# EAGLE design Un_Arduino (EAGLE 6.5.0)
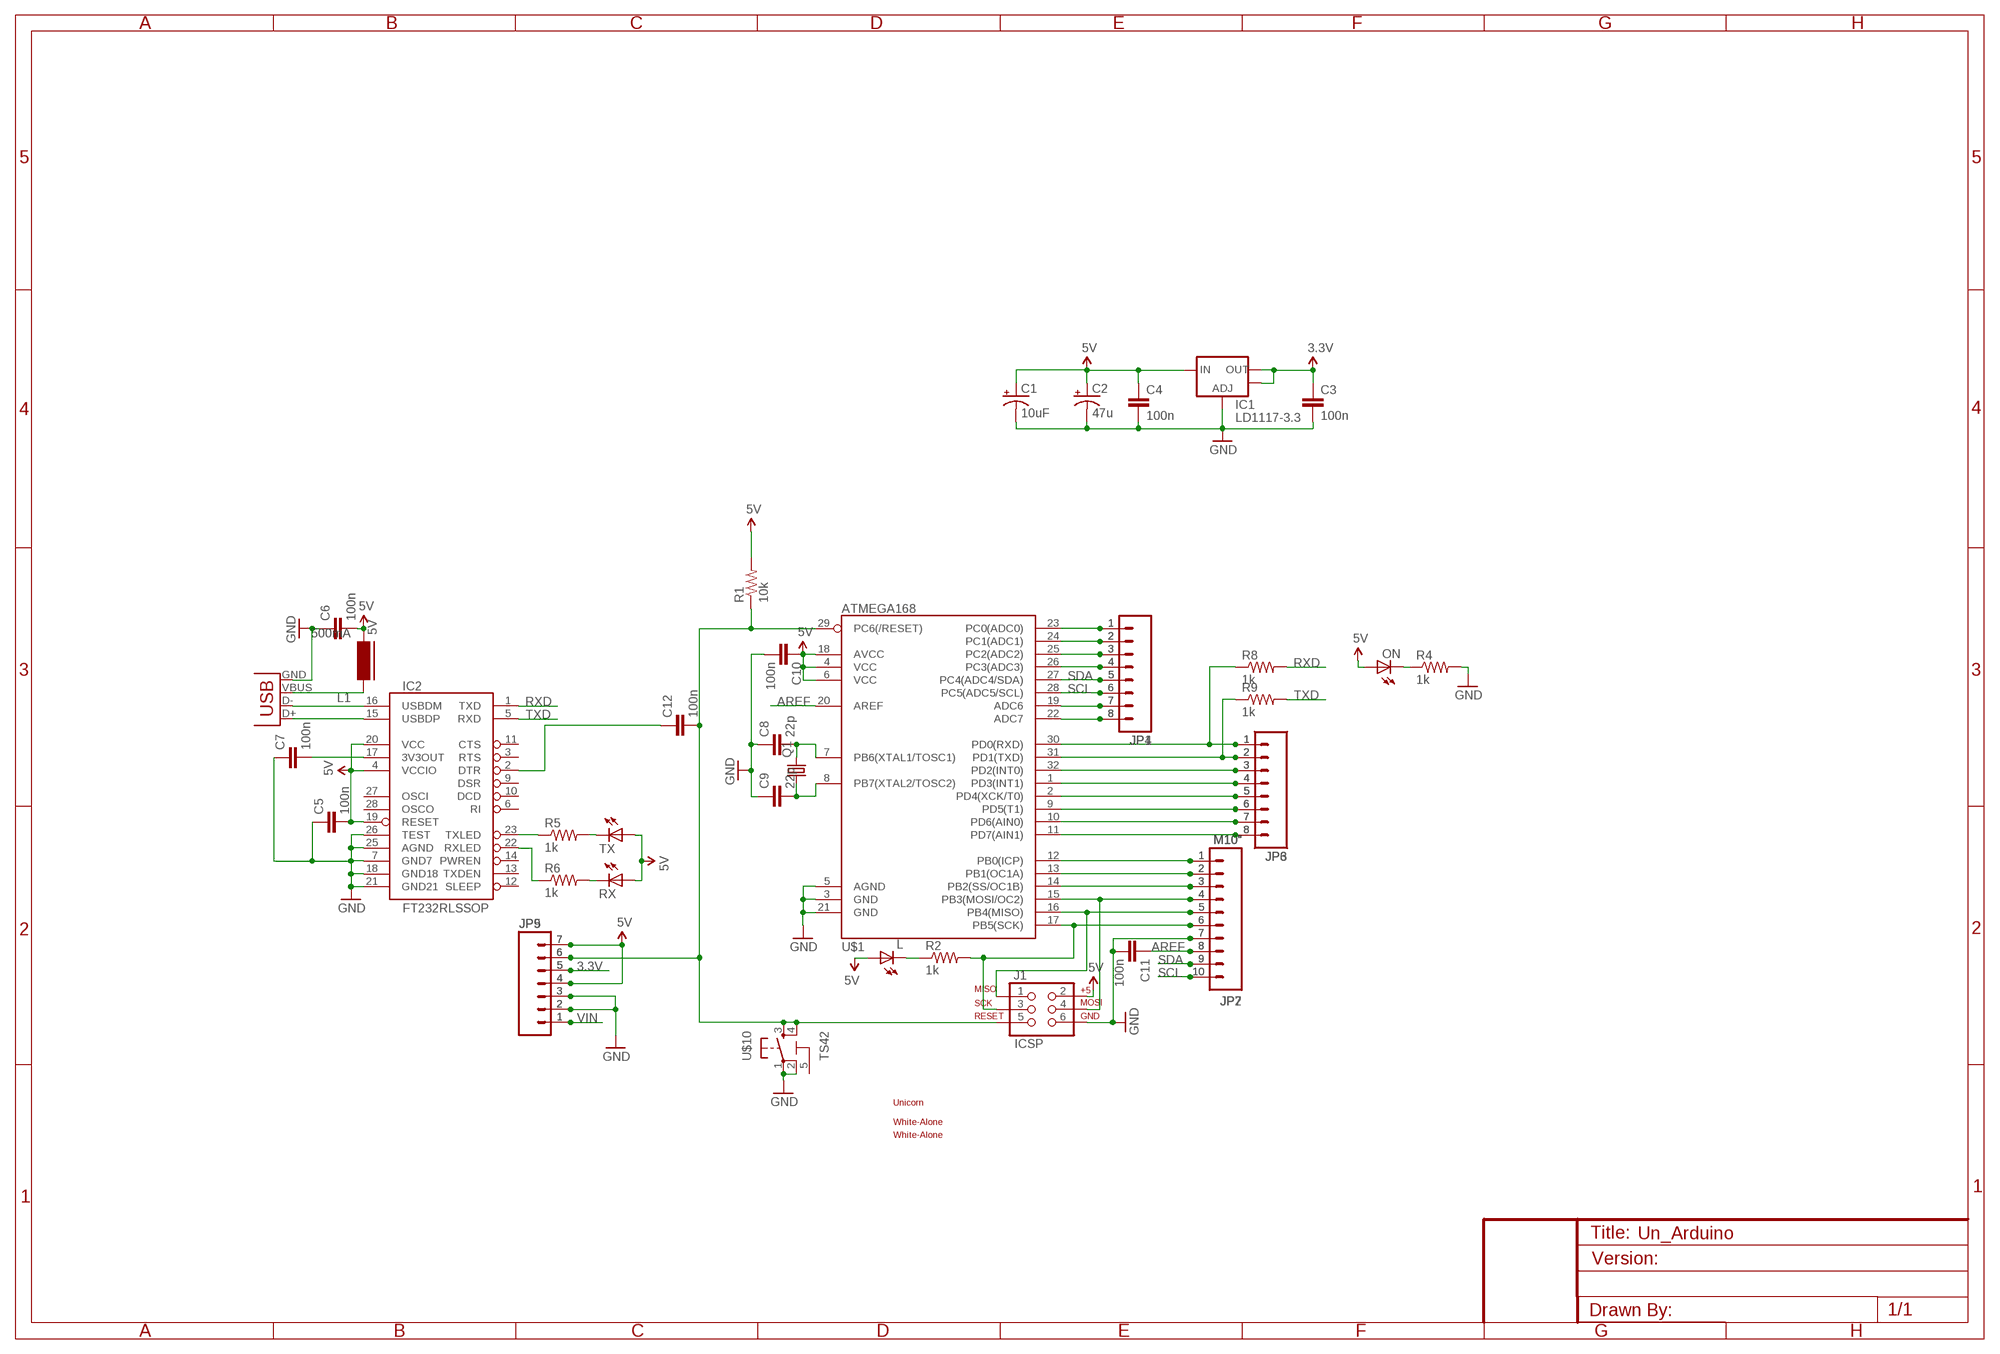
[diagram p0: schematic, sheet 1]

## Parts
C1  10uF  CAP_POL1206  [EIA3216]
C2  47u  CAP_POLD  [PANASONIC_D]
C3  100n  CAP0603-CAP  [0603-CAP]
C4  100n  CAP0603-CAP  [0603-CAP]
C5  100n  CAP0603-CAP  [0603-CAP]
C6  100n  CAP0603-CAP  [0603-CAP]
C7  100n  CAP0603-CAP  [0603-CAP]
C8  22p  CAP0603-CAP  [0603-CAP]
C9  22p  CAP0603-CAP  [0603-CAP]
C10  100n  CAP0603-CAP  [0603-CAP]
C11  100n  CAP0603-CAP  [0603-CAP]
C12  100n  CAP0603-CAP  [0603-CAP]
IC1  LD1117-3.3  V_REG_LM1117SOT223  [SOT223]
IC2  FT232RLSSOP  [SSOP28DB]
J1  ICSP  AVR_SPI_PRG_6PTH  [2X3]
JP1  M081X08  [1X08]
JP2  M10"  [1X10]
JP3  M08  [1X08]
JP4  M081X08  [1X08]
JP5  M07  [1X07]
JP6  M08  [1X08]
JP7  M10"  [1X10]
JP9  M07  [1X07]
L  LED0805  [LED-0805]
L1  500mA  FERRITE-0805  [FB805]
ON  LED0805  [LED-0805]
Q1  CRYSTALHC49US  [HC49US]
R1  10k  RESISTOR0603-RES  [0603-RES]
R2  1k  RESISTOR0603-RES  [0603-RES]
R4  1k  RESISTOR0603-RES  [0603-RES]
R5  1k  RESISTOR0603-RES  [0603-RES]
R6  1k  RESISTOR0603-RES  [0603-RES]
R8  1k  RESISTOR0603-RES  [0603-RES]
R9  1k  RESISTOR0603-RES  [0603-RES]
RX  LED0805  [LED-0805]
TX  LED0805  [LED-0805]
U$1  ATMEGA168  [TQFP32-08]
U$4  UNICORN  [UNICORN_1]
U$10  TS42  [TS42]
U$13  WHITE-ALONE_0  [WHITE-ALONE_0]
U$14  WHITE-ALONE_0  [WHITE-ALONE_0]
X1  USBSMD  [USB-MINIB]

## Nets
3.3V: C3.1 IC1.2(OUT) IC1.4(OUT) JP5.5 JP9.5
5V: C1.A(+) C2.+ C4.1 C5.2 C6.2 C10.1 IC1.3(IN) IC2.4(VCCIO) IC2.19(RESET) IC2.20(VCC) J1.2 JP5.4 JP5.7 JP9.4 JP9.7 L1.2 L.1(A) ON.1(A) R1.2 RX.1(A) TX.1(A) U$1.4(VCC) U$1.6(VCC) U$1.18(AVCC)
A0: JP1.1 JP4.1 U$1.23(PC0(ADC0))
AREF: C11.1 JP2.8 JP7.8 U$1.20(AREF)
GND: C1.C(-) C2.- C3.2 C4.2 C5.1 C6.1 C7.1 C8.1 C9.1 C10.2 C11.2 IC1.1(ADJ) IC2.7(GND7) IC2.18(GND18) IC2.21(GND21) IC2.25(AGND) IC2.26(TEST) J1.6 JP2.7 JP5.2 JP5.3 JP7.7 JP9.2 JP9.3 R4.2 U$1.3(GND) U$1.5(AGND) U$1.21(GND) U$10.1 U$10.2 X1.GND
IO0: JP3.1 JP6.1 R8.1 U$1.30(PD0(RXD))
N$1: C7.2 IC2.17(3V3OUT)
N$2: IC2.23(TXLED) R5.1
N$3: L1.1 X1.VBUS
N$4: R5.2 TX.2(C)
N$5: IC2.16(USBDM) X1.D-
N$6: IC2.15(USBDP) X1.D+
N$7: R6.2 RX.2(C)
N$8: ON.2(C) R4.1
N$9: L.2(C) R2.1
N$10: IC2.22(RXLED) R6.1
N$12: JP1.7 JP4.7 U$1.19(ADC6)
N$13: JP1.8 JP4.8 U$1.22(ADC7)
N$15: C12.1 IC2.2(DTR)
N$16: JP2.1 JP7.1 U$1.12(PB0(ICP))
N$17: JP2.2 JP7.2 U$1.13(PB1(OC1A))
N$18: JP2.3 JP7.3 U$1.14(PB2(SS/OC1B))
N$19: J1.4 JP2.4 JP7.4 U$1.15(PB3(MOSI/OC2))
N$20: J1.1 JP2.5 JP7.5 U$1.16(PB4(MISO))
N$23: JP3.2 JP6.2 R9.1 U$1.31(PD1(TXD))
N$24: JP3.3 JP6.3 U$1.32(PD2(INT0))
N$25: JP3.4 JP6.4 U$1.1(PD3(INT1))
N$26: JP3.5 JP6.5 U$1.2(PD4(XCK/T0))
N$27: JP3.6 JP6.6 U$1.9(PD5(T1))
N$28: JP3.7 JP6.7 U$1.10(PD6(AIN0))
N$29: JP3.8 JP6.8 U$1.11(PD7(AIN1))
N$31: JP1.2 JP4.2 U$1.24(PC1(ADC1))
N$32: JP1.3 JP4.3 U$1.25(PC2(ADC2))
N$33: JP1.4 JP4.4 U$1.26(PC3(ADC3))
N$38: C12.2 J1.5 JP5.6 JP9.6 R1.1 U$1.29(PC6(/RESET)) U$10.3 U$10.4
N$39: C8.2 Q1.2 U$1.7(PB6(XTAL1/TOSC1))
N$40: C9.2 Q1.1 U$1.8(PB7(XTAL2/TOSC2))
RXD: IC2.1(TXD) R8.2
SCK: J1.3 JP2.6 JP7.6 R2.2 U$1.17(PB5(SCK))
SCL: JP1.6 JP2.10 JP4.6 JP7.10 U$1.28(PC5(ADC5/SCL))
SDA: JP1.5 JP2.9 JP4.5 JP7.9 U$1.27(PC4(ADC4/SDA))
TXD: IC2.5(RXD) R9.2
VIN: JP5.1 JP9.1
Unconnected: IC2.3(RTS) IC2.6(RI) IC2.9(DSR) IC2.10(DCD) IC2.11(CTS) IC2.12(SLEEP) IC2.13(TXDEN) IC2.14(PWREN) IC2.27(OSCI) IC2.28(OSCO) U$10.5

## Library data of the parts
C1 C2 = 2SparkFun:CAP_POL: Capacitor Polarized These are standard SMD and PTH capacitors. Normally 10uF, 47uF, and 100uF in electrolytic and tantalum varieties. Always verify the external diameter of the through hole cap, it varies with capacity, voltage, and manufacturer. The EIA devices should be standard.
C3-C11 = 2SparkFun:CAP: Capacitor Standard 0603 ceramic capacitor, and 0.1" leaded capacitor.
C12 = 1SparkFun:CAP: Capacitor Standard 0603 ceramic capacitor, and 0.1" leaded capacitor.
IC1 = 1SparkFun:V_REG_LM1117: Voltage Regulator LM1117 Standard adjustable voltage regulator but in SMD form. Spark Fun Electronics SKU : COM-00595
IC2 = 1SparkFun:FT232RL: USB UART FT232RL 4th Generation USB UART (USB <-> Serial) Controller. Spark Fun Electronics SKU : COM-00650
J1 = 2SparkFun:AVR_SPI_PRG_6: AVR ISP 6 Pin This is the reduced ISP connector for AVR programming. Common on Arduino. This footprint will take up less PCB space and can be used with a 10-pin to 6-pin adapter such as SKU: BOB-08508
JP1 JP4 = 2SparkFun:M08: Header 8 Standard 8-pin 0.1" header. Use with straight break away headers (SKU : PRT-00116), right angle break away headers (PRT-00553), swiss pins (PRT-00743), machine pins (PRT-00117), and female headers (PRT-00115).
JP2 JP7 = 1SparkFun:M10: Header 10 Standard 10-pin 0.1" header. Use with straight break away headers (SKU : PRT-00116), right angle break away headers (PRT-00553), swiss pins (PRT-00743), machine pins (PRT-00117), and female headers (PRT-00115).
JP3 JP6 = 1SparkFun:M08: Header 8 Standard 8-pin 0.1" header. Use with straight break away headers (SKU : PRT-00116), right angle break away headers (PRT-00553), swiss pins (PRT-00743), machine pins (PRT-00117), and female headers (PRT-00115).
JP5 JP9 = 2SparkFun:M07: Header 7 Standard 7-pin 0.1" header. Use with straight break away headers (SKU : PRT-00116), right angle break away headers (PRT-00553), swiss pins (PRT-00743), machine pins (PRT-00117), and female headers (PRT-00115). NOTES ON THE VARIANTS LOCK and LOCK_LONGPADS... This footprint was designed to help hold the alignment of a through-hole component (i.e. 7-pin header) while soldering it into place. You may notice that each hole has been shifted either up or down by 0.005 of an inch from it's more standard position (which is usually a perfectly straight line). This slight alteration caused the pins (the squares in the middle) to touch the edges of the holes. Because they are alternating, it causes a "brace" to hold the header in place. 0.005 has proven to be the perfect amount of "off-center" position when using our standard breakaway headers. Although looks a little odd when you look at the bare footprint, once you have a header in there, the alteration is very hard to notice. Also, if you push a header all the way into place, it is covered up entirely on the bottom side. This idea of altering the position of holes to aid alignment will be further integrated into the Sparkfun Library for other footprints. It can help hold any component with 3 or more connection pins.
L ON RX TX = 1SparkFun:LED: LEDs Standard schematic elements and footprints for 5mm, 3mm, 1206, and 0603 sized LEDs. 5mm - Spark Fun Electronics SKU : COM-00529 (and others)
L1 = 2SparkFun:FERRITE: Ferrite bead in various packages
Q1 = 1SparkFun:CRYSTAL: Crystals Various standard crystals. Proven footprints. Spark Fun Electronics SKU : COM-00534
R1 R2 R4-R6 R8 R9 = 2SparkFun:RESISTOR: Resistor Basic schematic elements and footprints for 0603, 1206, and PTH resistors.
U$1 = 1SparkFun:ATMEGA168
U$4 = 2SparkFun:UNICORN
U$10 = 2SparkFun:TS42
U$13 U$14 = 2SparkFun:WHITE-ALONE
X1 = 2SparkFun:USB: USB Connectors USB-B-PTH is fully proven SKU : PRT-00139 USB-miniB is fully proven SKU : PRT-00587 USB-A-PCB is untested. USB-A-H is throughly reviewed, but untested. Spark Fun Electronics SKU : PRT-00437 USB-B-SMT is throughly reviewed, but untested. Needs silkscreen touching up. USB-A-S has not been used/tested USB-MB-H has not been used/tested

## Net classes
0 default: width 0.254 mm, clearance 0.254 mm
1 power: width 0.61 mm, drill 0.61 mm, clearance 0.254 mm
2 gnd: width 0.305 mm, drill 0.559 mm, clearance 0.254 mm
3 usbvcc: width 0.508 mm, drill 0.61 mm, clearance 0.254 mm
4 aref: width 0.406 mm, drill 0.61 mm, clearance 0.254 mm

## Board
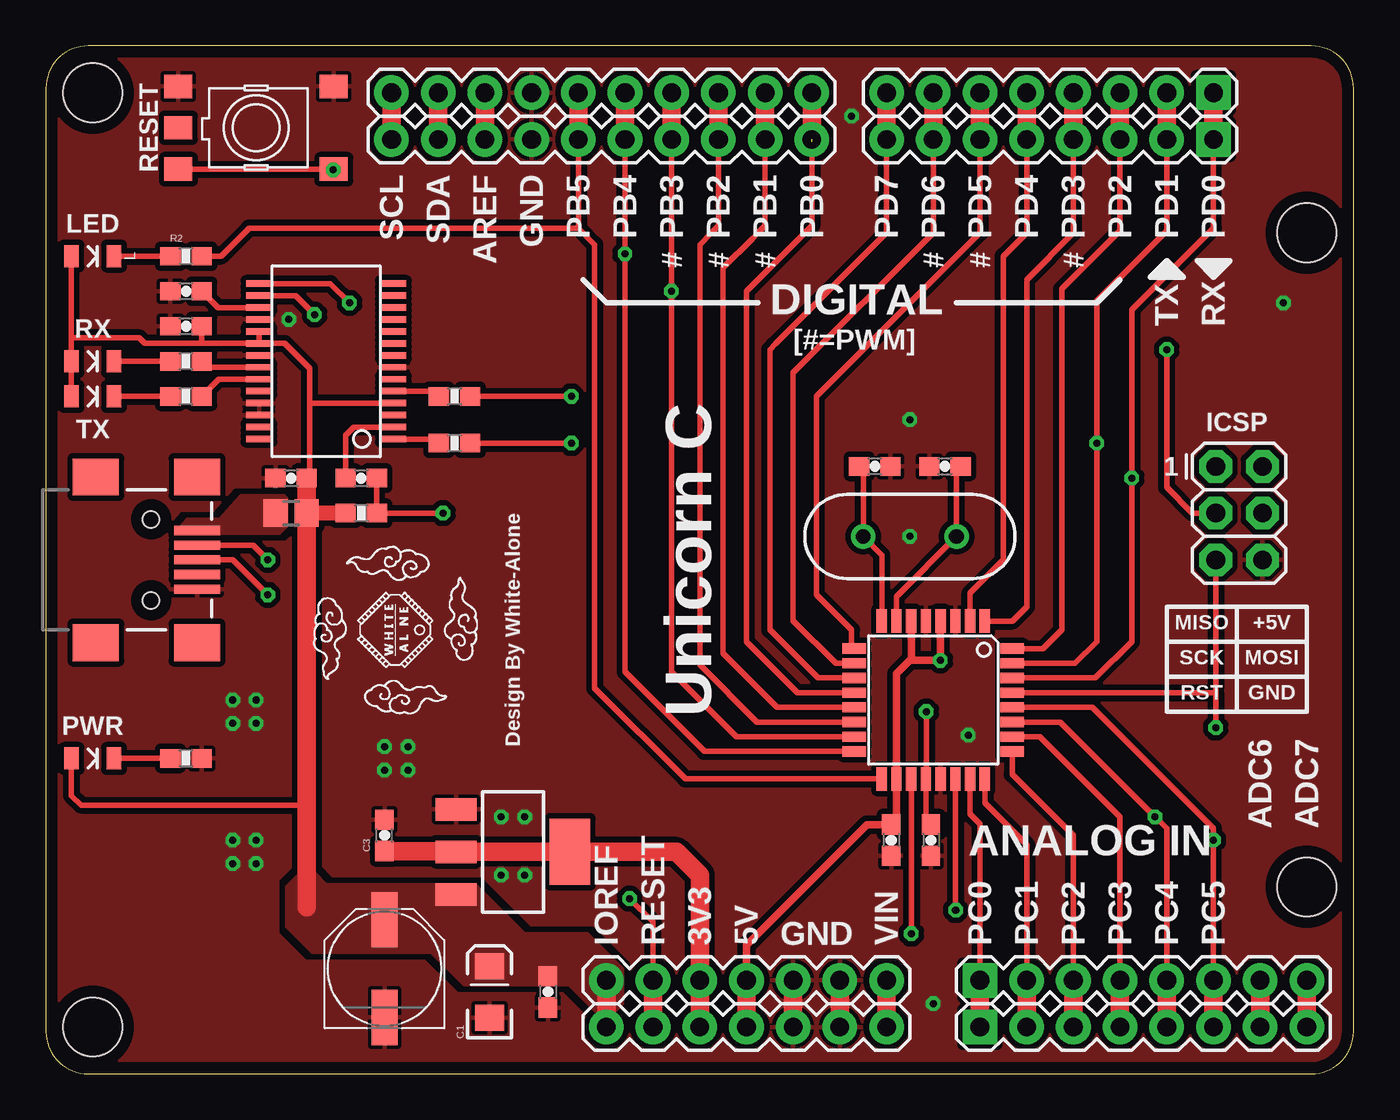
[diagram p1: board, top side]
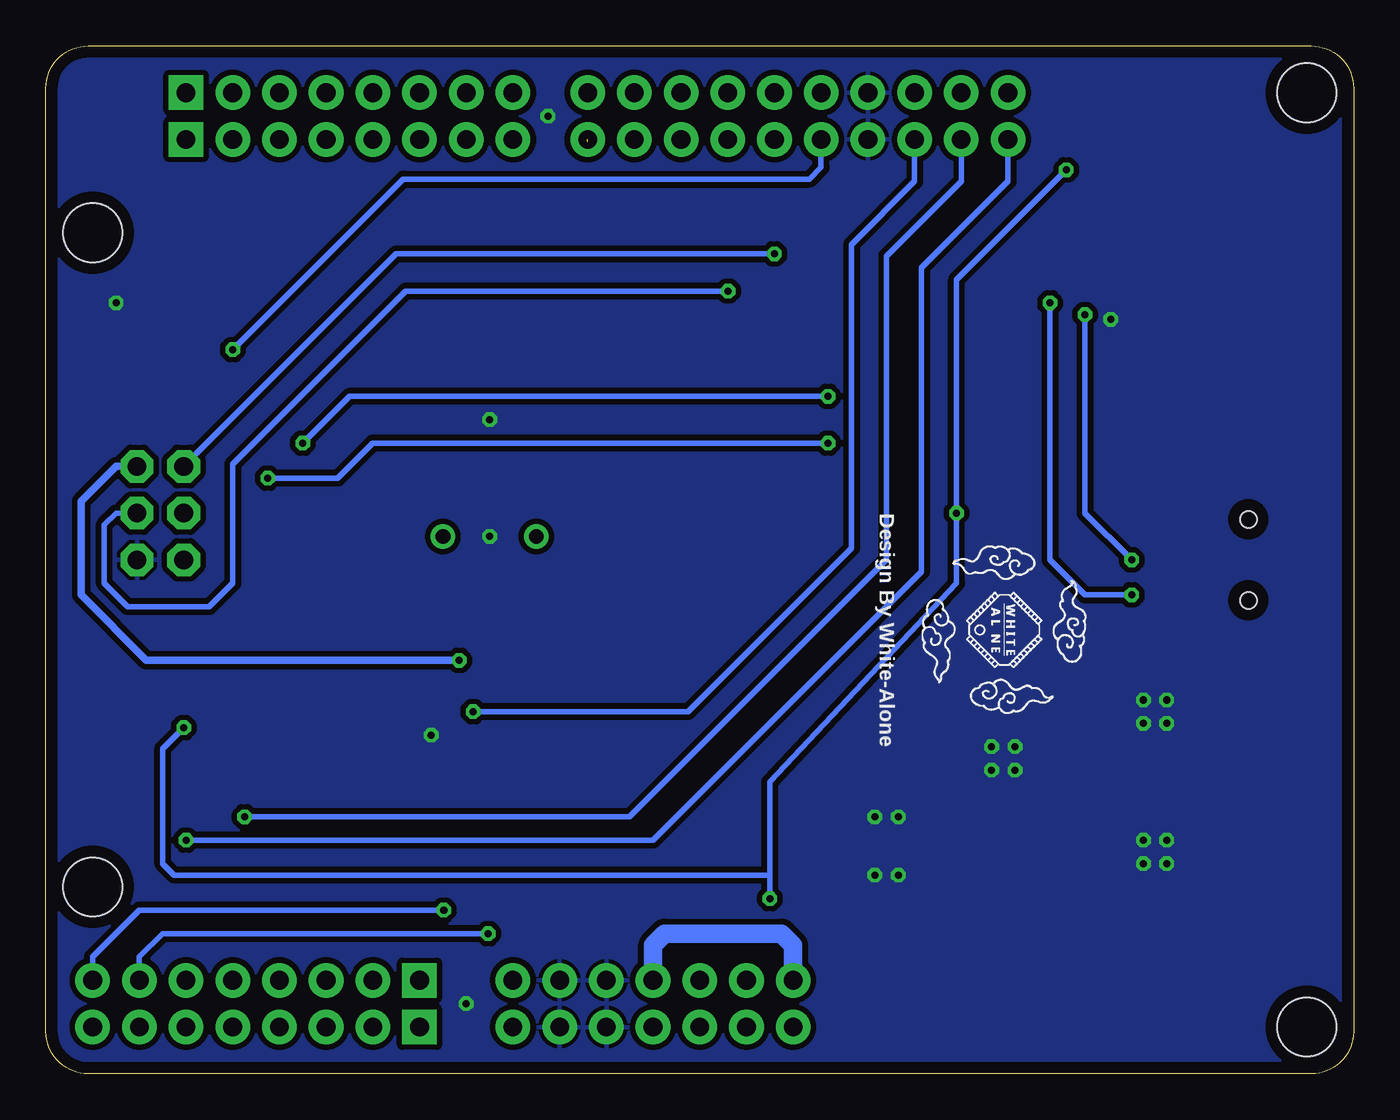
[diagram p2: board, bottom side, seen from below]

Size 71.12 x 55.88 mm. Coordinates in mm from the lower left corner, seen from the top.
Copper layers (1*16): Top 0.035mm / dielectric 1.5mm / Bottom 0.035mm
Design rules "yun": minimum track width 8mil, minimum drill 15mil, track to track 8mil, track to pad 8mil, pad to pad 8mil, via to via 8mil, smd to smd 8mil, copper to edge 25mil, drill to drill 8mil, minimum pad ring 10mil, minimum via ring 8mil, stop-mask expansion 4mil, vias tented up to drill 20mil, thermal gap 8mil

### Footprints (pad centres in the part's own frame; a part is rotated, then mirrored left to right if it is on the bottom)
EIA3216 = smd 1.4 x 1.6: A 1.4,0; C -1.4,0
PANASONIC_D = smd 3 x 1.4: + 2.654,0; - -2.654,0
0603-CAP = smd 1.1 x 1: 1 -0.85,0; 2 0.85,0
SOT223 = smd 1.219 x 2.235: 1 -2.311,-3.099; 2 0,-3.099; 3 2.311,-3.099 | smd 3.6 x 2.2: 4 0,3.099
SSOP28DB = smd 0.348 x 1.397: 1 -4.225,-3.656; 2 -3.575,-3.656; 3 -2.925,-3.656; 4 -2.275,-3.656; 5 -1.625,-3.656; 6 -0.975,-3.656; 7 -0.325,-3.656; 8 0.325,-3.656; 9 0.975,-3.656; 10 1.625,-3.656; 11 2.275,-3.656; 12 2.925,-3.656; 13 3.575,-3.656; 14 4.225,-3.656; 15 4.225,3.656; 16 3.575,3.656; 17 2.925,3.656; 18 2.275,3.656; 19 1.625,3.656; 20 0.975,3.656; 21 0.325,3.656; 22 -0.325,3.656; 23 -0.975,3.656; 24 -1.625,3.656; 25 -2.275,3.656; 26 -2.925,3.656; 27 -3.575,3.656; 28 -4.225,3.656
2X3 = drill 1.016 pad 1.778 octagon: 1 0,0; 2 0,2.54; 3 2.54,0; 4 2.54,2.54; 5 5.08,0; 6 5.08,2.54
1X08 = drill 1.016 pad 1.88 square: 1 0,0 | drill 1.016 pad 1.88: 2 2.54,0; 3 5.08,0; 4 7.62,0; 5 10.16,0; 6 12.7,0; 7 15.24,0; 8 17.78,0
1X10 = drill 1.016 pad 1.88: 1 0,0; 2 2.54,0; 3 5.08,0; 4 7.62,0; 5 10.16,0; 6 12.7,0; 7 15.24,0; 8 17.78,0; 9 20.32,0; 10 22.86,0
1X07 = drill 1.016 pad 1.88: 1 0,0; 2 2.54,0; 3 5.08,0; 4 7.62,0; 5 10.16,0; 6 12.7,0; 7 15.24,0
LED-0805 = smd 0.8 x 1.2: 1 -1.154,0; 2 1.154,0
FB805 = smd 1.3 x 1.5: 1 -0.85,0; 2 0.85,0
HC49US = drill 0.813: 1 -2.54,0; 2 2.54,0
0603-RES = smd 1.1 x 1: 1 -0.85,0; 2 0.85,0
TQFP32-08 = smd 1.27 x 0.559: 1 -4.293,2.8; 2 -4.293,2; 3 -4.293,1.2; 4 -4.293,0.4; 5 -4.293,-0.4; 6 -4.293,-1.2; 7 -4.293,-2; 8 -4.293,-2.8; 17 4.293,-2.8; 18 4.293,-2; 19 4.293,-1.2; 20 4.293,-0.4; 21 4.293,0.4; 22 4.293,1.2; 23 4.293,2; 24 4.293,2.8 | smd 0.559 x 1.27: 9 -2.8,-4.293; 10 -2,-4.293; 11 -1.2,-4.293; 12 -0.4,-4.293; 13 0.4,-4.293; 14 1.2,-4.293; 15 2,-4.293; 16 2.8,-4.293; 25 2.8,4.293; 26 2,4.293; 27 1.2,4.293; 28 0.4,4.293; 29 -0.4,4.293; 30 -1.2,4.293; 31 -2,4.293; 32 -2.8,4.293
UNICORN_1 = hole 3.2: -30.48,-25.4; 35.56,17.78; 35.56,-17.78; -30.48,25.4
TS42 = smd 1.524 x 1.27: 1 -4.229,2.25; 2 4.229,2.25; 3 -4.229,-2.25; 4 4.229,-2.25; 5 -4.229,-0.002
USB-MINIB = smd 2.5 x 0.5: D+ 2.5,0; D- 2.5,0.8; GND 2.5,-1.6; ID 2.5,-0.8; VBUS 2.5,1.6 | smd 2.5 x 2: MTN1 -3,4.5; MTN2 2.5,4.5; MTN3 -3,-4.5; MTN4 2.5,-4.5 | hole 0.9: 0,2.2; 0,-2.2

### Placement (x,y rotation side)
C1  24.13,4.45 90 top
C2  18.42,5.71 90 top
C3  18.42,12.95 90 top
C4  27.31,4.45 270 top
C5  7.62,40.64 0 top
C6  13.34,32.38 0 top
C7  7.62,42.55 0 top
C8  48.9,33.02 0 top
C9  45.09,33.02 180 top
C10  45.97,12.7 270 top
C11  48.13,12.7 270 top
C12  17.15,32.38 0 top
IC1  25.4,12.06 270 top
IC2  15.24,38.73 90 top
J1  63.63,33.02 270 top
JP1  50.8,5.08 0 top
JP2  41.66,53.34 180 top
JP3  63.5,53.34 180 top
JP4  50.8,2.54 0 top
JP5  45.72,2.54 180 top
JP6  63.5,50.8 180 top
JP7  41.66,50.8 180 top
JP9  45.72,5.08 180 top
L  2.54,44.45 0 top
L1  13.34,30.48 0 top
ON  2.54,17.14 0 top
Q1  46.99,29.21 0 top
R1  17.15,30.48 180 top
R2  7.62,44.45 0 top
R4  7.62,17.14 0 top
R5  7.62,36.83 180 top
R6  7.62,38.73 180 top
R8  22.23,34.29 180 top
R9  22.23,36.83 180 top
RX  2.54,38.73 0 top
TX  2.54,36.83 0 top
U$1  48.26,20.32 270 top
U$4  33.02,27.94 0 top
U$10  11.43,51.44 0 top
U$13  19.05,24.13 90 top
U$14  19.05,24.13 270 bottom
X1  5.72,27.94 0 top

### Tracks (layer width: path | path; a pad name or v marks a point on that pad's centre or on a via)
3.3V
  Top 1.016: JP5.5 JP9.5 35.56,10.79 34.29,12.06 IC1.4 IC1.2 22.26,12.1 C3.1
5V  (via drill 0.38)
  Top 0.305: 48.64,24.64 48.64,24.51 48.66,24.53 U$1.4 | 47.06,22.55 46.99,22.48 | C6.2 14.34,32.54 14.34,36.46 | TX.1 RX.1 1.39,40.01 | IC2.20 8.47,39.71 | 8.47,39.71 5.38,39.71 5.08,40.01 1.39,40.01 | IC2.20 IC2.19 | C5.2 8.47,39.71 | ON.1 1.39,15.12 1.91,14.61 14.19,14.61 | 1.39,40.01 L.1 | IC2.20 13,39.71 14.34,38.37 14.34,36.46 | IC2.4 14.34,36.46
  Top 0.406: 48.64,24.51 v48.64,22.48 46.99,22.48 46.26,21.75 U$1.18 46.26,13.84 C10.1 44.67,13.55 38.1,6.99 JP9.4 | U$1.6 47.06,22.55
  Top 0.813: R1.2 L1.2
  Top 1.016: JP5.7 JP9.7 | JP5.4 JP9.4 | C6.2 L1.2 14.19,14.61 14.19,9.06
  Bottom 0.406: v48.64,22.48 65.66,22.48 69.22,26.04 69.22,31.11 67.31,33.02 J1.2
  Bottom 1.016: JP9.4 38.1,6.99 37.47,7.62 31.12,7.62 30.48,6.99 JP9.7
  pour Top (no thermals): 13.08,8 14.48,6.6 20.96,6.6 22.73,4.83 28.45,4.83 29.97,3.3 30.86,3.3 31.37,3.81 31.37,5.71 29.46,7.62 26.04,7.62 23.37,10.29 15.24,10.29 14.61,10.92 13.84,10.92 13.08,10.16
A0
  Top 0.305: U$1.23 50.26,14.13 50.8,13.59 JP1.1
  Top 1.016: JP1.1 JP4.1
AREF  (via drill 0.38)
  Top 0.305: v47.88,19.68 47.88,15.51 47.86,15.49 | 47.86,15.49 47.86,13.82 C11.1 | 47.86,15.49 U$1.20
  Top 1.016: JP2.8 JP7.8
  Bottom 0.305: JP7.8 23.88,48.51 27.31,45.09 27.31,28.57 36.2,19.68 v47.88,19.68
GND  (via drill 0.38)
  Top 1.016: JP5.2 JP9.2 | JP5.3 JP9.3
  other vias: 67.31,41.91 50.17,18.41 48.26,3.81 24.77,10.79 26.04,10.79 26.04,13.97 24.77,13.97 13.21,41.02 10.16,20.32 11.43,20.32 11.43,19.05 10.16,19.05 46.99,35.56 46.99,29.21 43.82,52.07 18.42,16.51 19.69,16.51 19.69,17.78 18.42,17.78 10.16,12.7 11.43,12.7 10.16,11.43 11.43,11.43
  pour Top (isolate 0.305, rank 2): 0,55.88 71.12,55.88 71.12,0 0,0
  pour Bottom (isolate 0.305, rank 2): 0,55.88 71.12,55.88 71.12,0 0,0
IO0  (via drill 0.38)
  Top 0.305: JP6.1 63.5,45.97 59.06,41.53 v59.06,32.38 59.06,23.5 57.08,21.52 U$1.30 | R8.1 v28.58,34.29
  Top 1.016: JP3.1 JP6.1
  Bottom 0.305: v28.58,34.29 53.34,34.29 55.25,32.38 v59.06,32.38
N$1
  Top 0.305: IC2.17 9.36,41.66 C7.2
N$2
  Top 0.305: IC2.23 9.4,37.76 R5.1
N$3
  pour Top (no thermals): 7.42,29.39 12.7,29.39 13.08,29.77 13.08,31.29 12.95,31.42 10.59,31.42 9.45,30.15 7.67,30.15 7.29,29.72 7.29,29.46
N$4
  Top 0.305: TX.2 R5.2
N$5  (via drill 0.38)
  Top 0.305: IC2.16 13.57,42.31 v14.61,41.27 | v12.07,27.94 11.27,28.74 X1.D-
  Bottom 0.305: v14.61,41.27 14.61,30.48 v12.07,27.94
N$6  (via drill 0.38)
  Top 0.305: X1.D+ 10.16,27.94 v12.07,26.04 | IC2.15 15.46,42.96 v16.51,41.91
  Bottom 0.305: v16.51,41.91 16.51,27.94 14.61,26.04 v12.07,26.04
N$7
  Top 0.305: RX.2 R6.2
N$8
  Top 0.305: ON.2 R4.1
N$9
  Top 0.305: L.2 R2.1
N$10
  Top 0.305: IC2.22 8.8,38.41 R6.1
N$12  (via drill 0.38)
  Top 0.305: U$1.19 v47.06,7.63 v47.07,7.62
  Top 1.016: JP1.7 JP4.7
  Bottom 0.305: v47.07,7.62 64.77,7.62 66.04,6.35 JP1.7
N$13  (via drill 0.38)
  Top 0.305: U$1.22 49.46,8.91 v49.48,8.89
  Top 1.016: JP1.8 JP4.8
  Bottom 0.305: v49.48,8.89 66.04,8.89 68.58,6.35 JP1.8
N$15
  Top 0.305: C12.1 16.3,34.71 16.75,35.16 IC2.2
N$16  (1 unrouted)
  Top 0.305: 41.91,50.93 41.66,50.67 41.66,46.1 38.1,42.55 38.1,23.5 40.88,20.72 U$1.12
  Top 1.016: JP2.1 JP7.1
N$17
  Top 0.305: U$1.13 43.95,19.94 39.75,19.94 36.83,22.86 36.83,43.81 38.42,45.4 38.74,45.72 39.12,46.1 JP7.2
  Top 1.016: JP2.2 JP7.2
N$18
  Top 0.305: U$1.14 38.67,19.12 35.56,22.23 35.56,45.09 36.2,45.72 36.58,46.1 JP7.3
  Top 1.016: JP2.3 JP7.3
N$19  (via drill 0.38)
  Top 0.305: U$1.15 37.56,18.32 34.04,21.84 34.04,45.72 v34.02,42.56 34.04,45.74 JP7.4
  Top 1.016: JP2.4 JP7.4
  Bottom 0.305: J1.4 67.31,30.48 67.94,29.84 67.94,26.67 66.68,25.4 62.23,25.4 60.96,26.67 60.96,33.15 51.55,42.56 v34.02,42.56
N$20  (via drill 0.38)
  Top 0.305: 43.97,17.5 43.94,17.53 35.81,17.53 31.5,21.84 v31.5,44.58 JP7.5 | U$1.16 43.97,17.5 | 43.97,17.5 44.07,17.4
  Top 1.016: JP2.5 JP7.5
  Bottom 0.305: v31.5,44.58 52.07,44.58 J1.1
N$23  (via drill 0.38)
  Top 0.305: JP6.2 60.96,45.85 57.15,42.04 v57.15,34.29 57.15,23.5 55.98,22.32 U$1.31 | R9.1 v28.58,36.83
  Top 1.016: JP3.2 JP6.2
  Bottom 0.305: v28.58,36.83 54.61,36.83 v57.15,34.29
N$24
  Top 0.305: JP6.3 58.42,45.85 55.25,42.67 55.25,24.13 54.24,23.12 U$1.32
  Top 1.016: JP3.3 JP6.3
N$25
  Top 0.305: U$1.1 52.55,24.61 53.34,25.4 53.34,43.18 55.88,45.72 JP6.4
  Top 1.016: JP3.4 JP6.4
N$26
  Top 0.305: U$1.2 50.26,26.13 52.07,27.94 52.07,44.45 53.34,45.72 JP6.5
  Top 1.016: JP3.5 JP6.5
N$27
  Top 0.305: U$1.9 43.82,23.27 43.82,24.13 41.91,26.04 41.91,36.83 50.8,45.72 JP6.6
  Top 1.016: JP3.6 JP6.6
N$28
  Top 0.305: U$1.10 42.96,22.32 40.64,24.64 40.64,38.1 48.26,45.72 JP6.7
  Top 1.016: JP3.7 JP6.7
N$29
  Top 0.305: U$1.11 41.98,21.52 39.37,24.13 39.37,39.37 39.69,39.69 45.72,45.72 JP6.8
  Top 1.016: JP3.8 JP6.8
N$31
  Top 0.305: U$1.24 51.06,14.73 53.34,12.45 53.34,6.1 53.34,5.71 JP1.2
  Top 1.016: JP4.2 JP1.2
N$32
  Top 0.305: U$1.25 52.55,16.28 55.88,12.95 JP1.3
  Top 1.016: JP1.3 JP4.3
N$33
  Top 0.305: U$1.26 54.07,18.32 58.42,13.97 JP1.4
  Top 1.016: JP4.4 JP1.4
N$38  (via drill 0.38)
  Top 0.305: U$10.3 U$10.4 v15.62,49.15 | J1.5 63.63,20.95 63.63,20.72 | 63.63,20.72 v63.63,18.82 | C12.2 R1.1 v21.59,30.48 | JP9.6 33.02,8.26 v31.75,9.53 | U$1.29 63.63,20.72
  Top 1.016: JP5.6 JP9.6
  Bottom 0.305: 31.75,10.79 64.14,10.79 64.77,11.43 64.77,17.68 v63.63,18.82 | v31.75,9.53 31.75,10.79 | 31.75,10.79 31.75,15.88 21.59,26.67 v21.59,30.48 21.59,43.18 v15.62,49.15
N$39
  Top 0.305: C8.2 49.53,32.8 Q1.2 46.26,25.94 U$1.7
N$40
  Top 0.305: C9.2 44.45,32.8 Q1.1 45.46,28.2 U$1.8
RXD
  Top 0.305: IC2.1 21.16,34.51 R8.2
SCK  (via drill 0.38)
  Top 0.305: 45.47,16 45.34,16 45.36,16.03 U$1.17 34.77,16.03 29.85,20.95 29.85,45.09 28.96,45.97 | J1.3 62.36,30.48 60.96,31.88 v60.96,39.37 | JP7.6 28.96,45.97 | 28.96,45.97 11.05,45.97 9.53,44.45 R2.2
  Top 1.016: JP2.6 JP7.6
  Bottom 0.305: JP7.6 28.96,49.28 29.59,48.64 51.69,48.64 v60.96,39.37
SCL  (via drill 0.38)
  Top 0.305: U$1.28 56.92,19.92 63.5,13.34 v63.5,12.7 JP1.6
  Top 1.016: JP2.10 JP7.10 | JP1.6 JP4.6
  Bottom 0.305: v63.5,12.7 38.1,12.7 23.5,27.3 23.5,43.81 18.8,48.51 JP7.10
SDA  (via drill 0.38)
  Top 0.305: U$1.27 55.18,19.12 v60.33,13.97 60.96,13.34 JP1.5
  Top 1.016: JP2.9 JP7.9 | JP1.5 JP4.5
  Bottom 0.305: JP7.9 21.34,48.51 25.4,44.45 25.4,27.94 39.37,13.97 46.99,13.97 47.63,13.97 v60.33,13.97
TXD
  Top 0.305: IC2.5 21.1,37.11 R9.2
VIN
  Top 1.016: JP5.1 JP9.1

### Text on the board
tPlace: RESET | SCL | SDA | AREF | GND | PB5 | PB4 | PB3 | PB2 | PB1 | PB0 | PD7 | PD6 | PD5 | PD4 | PD3 | PD2 | PD1 | PD0 | LED | # | # | # | # | # | # | DIGITAL | TX | RX | RX | [#=PWM] | TX | ICSP | 1 | Unicorn C | Design By White-Alone | MISO | +5V | SCK | MOSI | RST | GND | PWR | ANALOG IN | ADC6 | ADC7 | IOREF | RESET | 3V3 | 5V | GND | VIN | PC0 | PC1 | PC2 | PC3 | PC4 | PC5
bPlace: Design By White-Alone